# EasyEDA schematic ble_car_0.1.json
TITLE: Sheet_1; REV: 1.0; Date: 2022-04-23; Sheet: 1/1; Company: Your Company
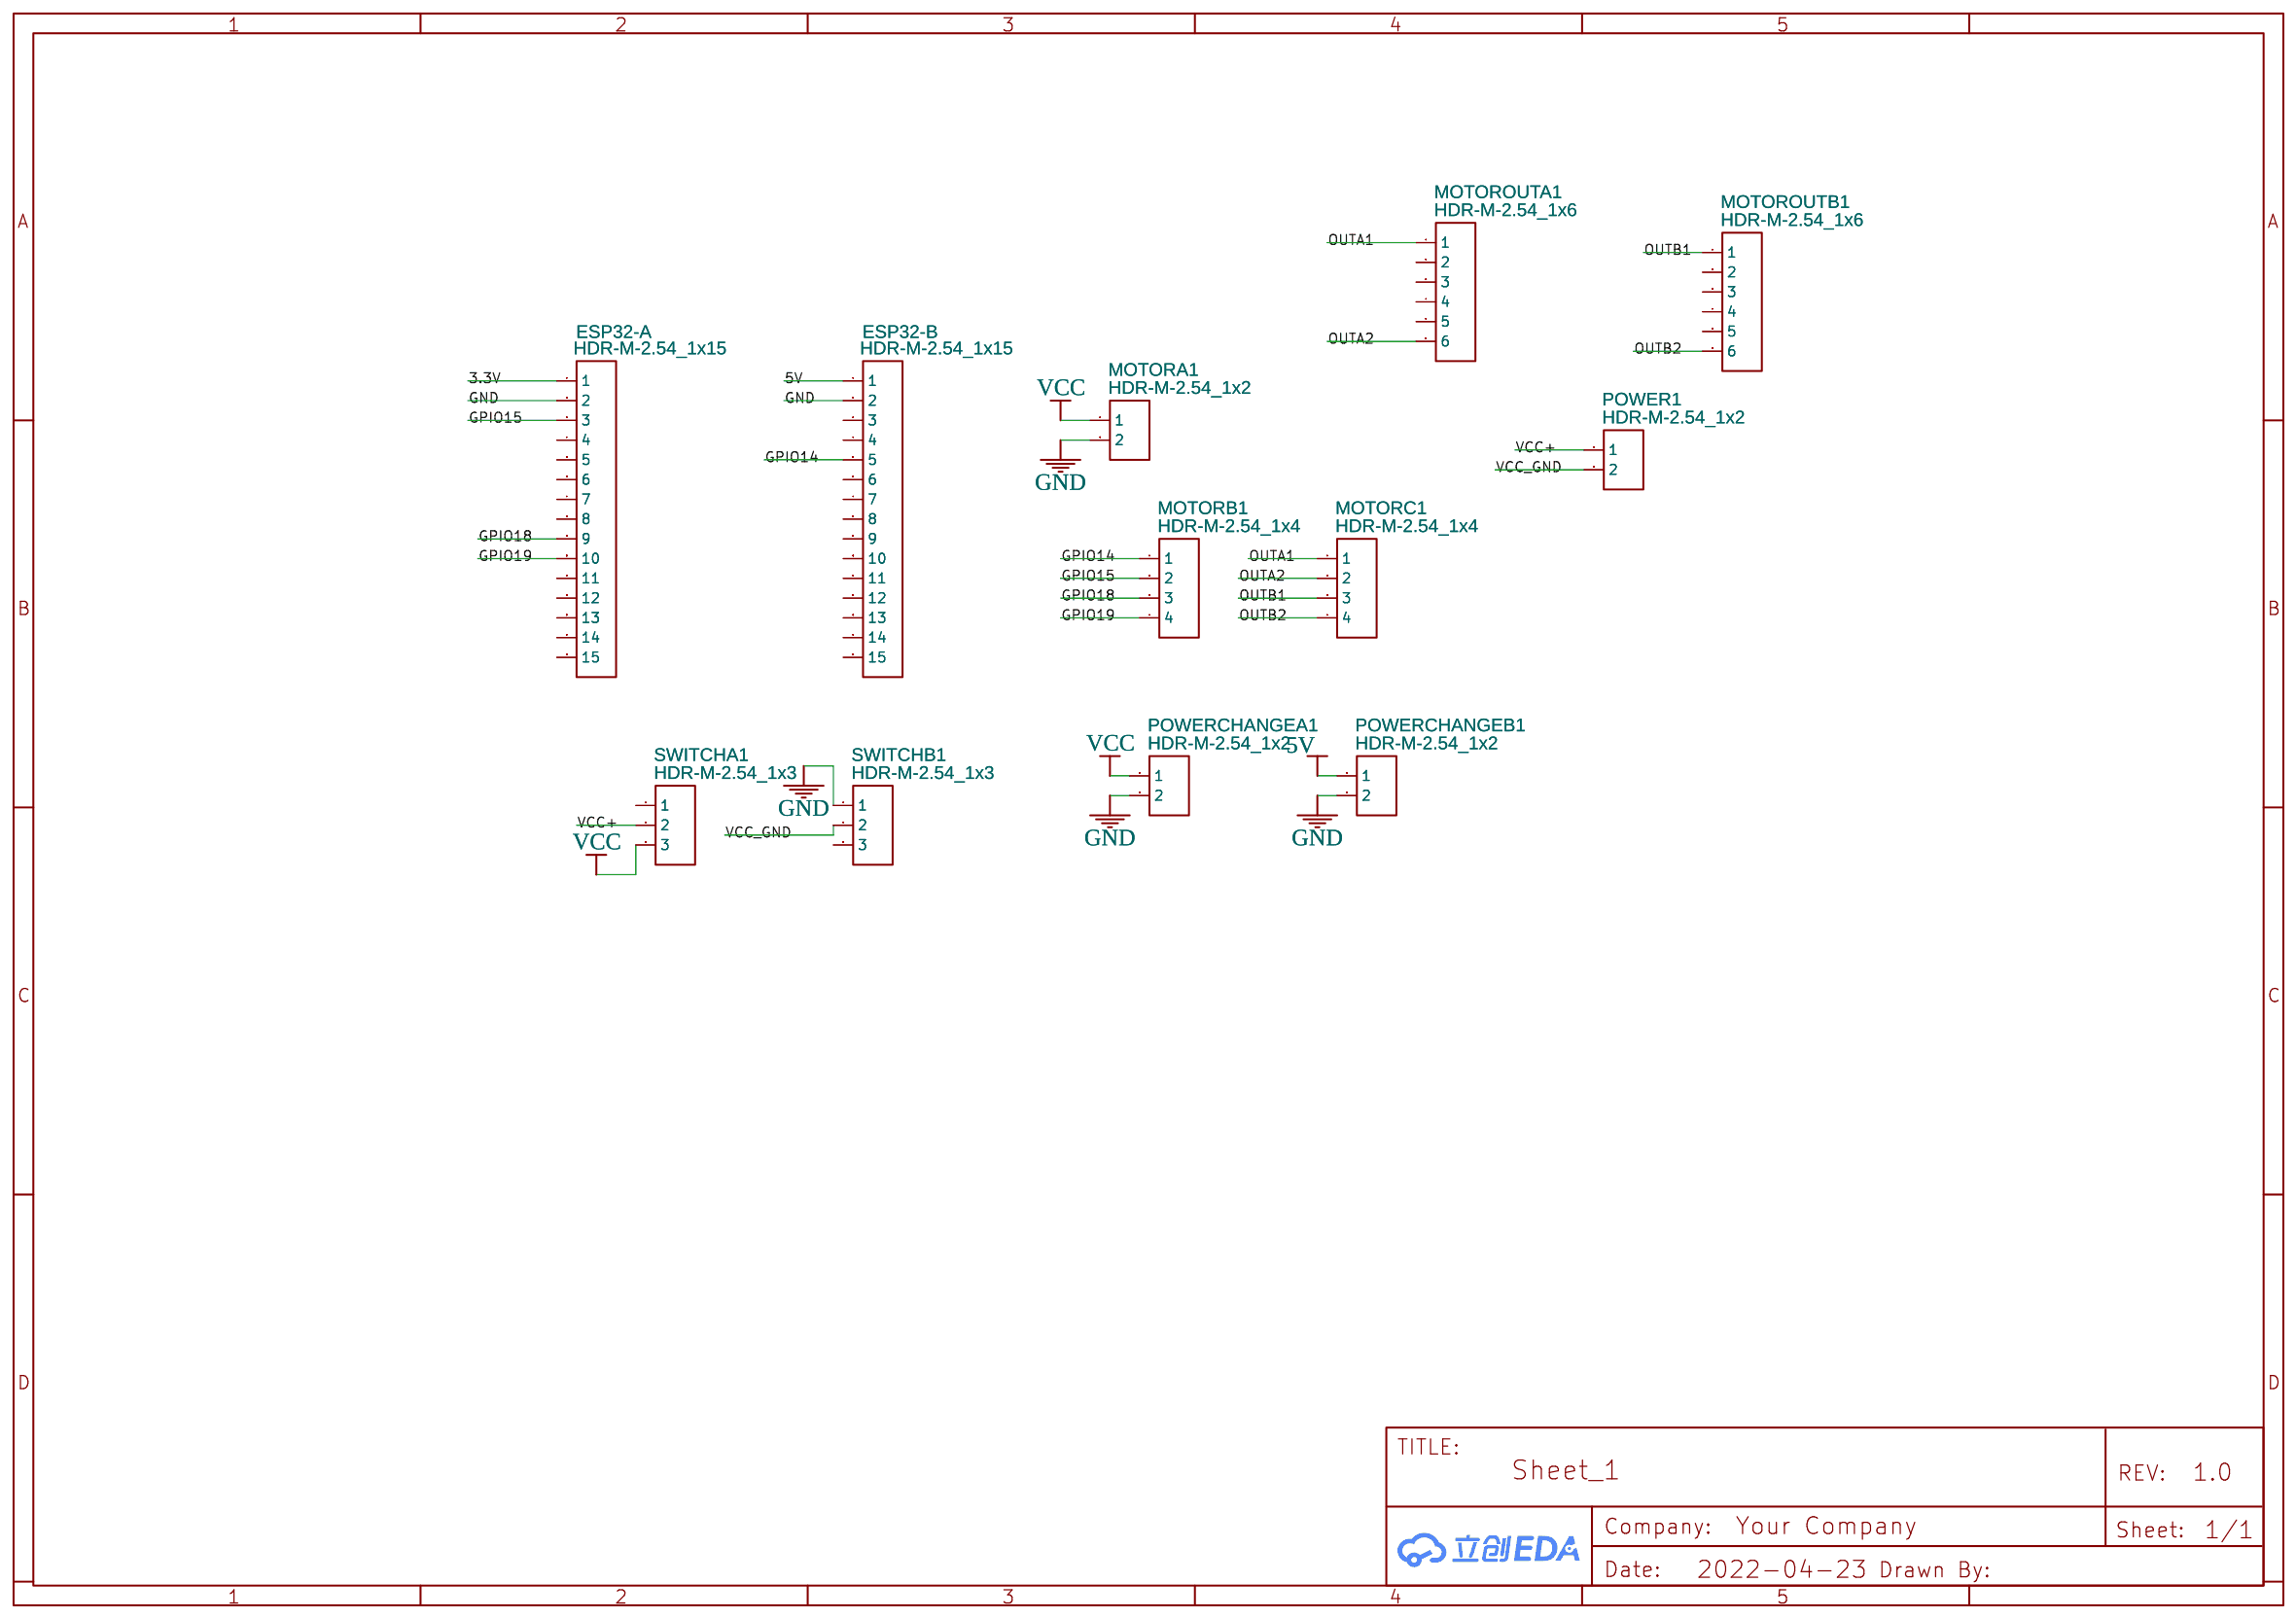
[diagram p0: schematic sheet]

## Parts
ESP32-A  HDR-M-2.54_1x15  [HDR-M-2.54_1X15]
ESP32-B  HDR-M-2.54_1x15  [HDR-M-2.54_1X15]
MOTORA1  HDR-M-2.54_1x2  [HDR-M-2.54_1X2]
MOTORB1  HDR-M-2.54_1x4  [HDR-M-2.54_1X4]
MOTORC1  HDR-M-2.54_1x4  [HDR-M-2.54_1X4]
MOTOROUTA1  HDR-M-2.54_1x6  [HDR-M-2.54_1X6]
MOTOROUTB1  HDR-M-2.54_1x6  [HDR-M-2.54_1X6]
POWER1  HDR-M-2.54_1x2  [HDR-M-2.54_1X2]
POWERCHANGEA1  HDR-M-2.54_1x2  [HDR-M-2.54_1X2]
POWERCHANGEB1  HDR-M-2.54_1x2  [HDR-M-2.54_1X2]
SWITCHA1  HDR-M-2.54_1x3  [HDR-M-2.54_1X3]
SWITCHB1  HDR-M-2.54_1x3  [HDR-M-2.54_1X3]

## Library data of the parts
ESP32-A ESP32-B = HDR-M-2.54_1x15: Supplier Part: C124373; Supplier: LCSC; Contributor: LCEDA_Lib
MOTORA1 POWER1 POWERCHANGEA1 POWERCHANGEB1 = HDR-M-2.54_1x2: Supplier Part: C124375; Supplier: LCSC; Contributor: LCEDA_Lib
MOTORB1 MOTORC1 = HDR-M-2.54_1x4: Supplier Part: C124378; Supplier: LCSC; Contributor: LCEDA_Lib
MOTOROUTA1 MOTOROUTB1 = HDR-M-2.54_1x6: Supplier Part: C190819; Supplier: LCSC; Contributor: LCEDA_Lib
SWITCHA1 SWITCHB1 = HDR-M-2.54_1x3: Supplier Part: C180248; Supplier: LCSC; Contributor: LCEDA_Lib

## Nets
3.3V: ESP32-A.1
5V: ESP32-B.1 POWERCHANGEB1.1
GND: ESP32-A.2 ESP32-B.2 MOTORA1.2 POWERCHANGEA1.2 POWERCHANGEB1.2 SWITCHB1.1
VCC: MOTORA1.1 POWERCHANGEA1.1 SWITCHA1.3
VCC+: POWER1.1 SWITCHA1.2
VCC_GND: POWER1.2 SWITCHB1.2
GPIO14: ESP32-B.5 MOTORB1.1
GPIO15: ESP32-A.3 MOTORB1.2
GPIO18: ESP32-A.9 MOTORB1.3
GPIO19: ESP32-A.10 MOTORB1.4
OUTA1: MOTORC1.1 MOTOROUTA1.1
OUTA2: MOTORC1.2 MOTOROUTA1.6
OUTB1: MOTORC1.3 MOTOROUTB1.1
OUTB2: MOTORC1.4 MOTOROUTB1.6

Not connected (* = marked no-connect by the designer): ESP32-A 4 5 6 7 8 11 12 13 14 15; ESP32-B 3 4 6 7 8 9 10 11 12 13 14 15; MOTOROUTA1 2 3 4 5; MOTOROUTB1 2 3 4 5; SWITCHA1 1; SWITCHB1 3
